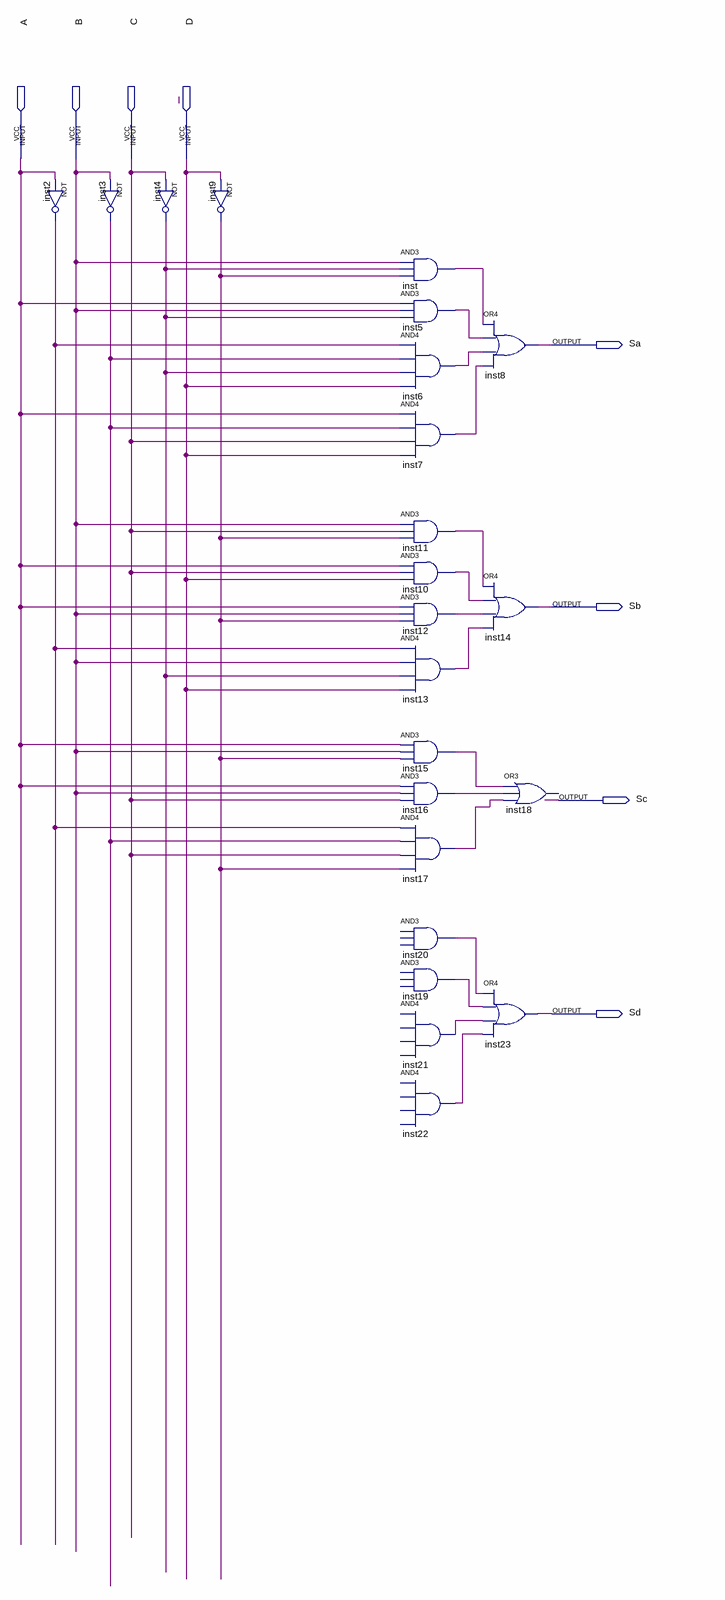
[diagram p0: schematic sheet]
// Quartus schematic lab03_vs.bdf as structural Verilog: 23 symbols, 8 pins
module lab03_vs (
  input  A,
  input  B,
  input  C,
  input  D,
  output Sa,
  output Sb,
  output Sc,
  output Sd
);

  wire inst2_out, inst3_out, inst4_out, inst5_out, inst6_out, inst7_out, inst9_out, inst10_out, inst11_out,
       inst12_out, inst13_out, inst15_out, inst16_out, inst17_out, inst19_out, inst20_out, inst21_out,
       inst22_out, inst_out;

  not inst2 (inst2_out, A);
  not inst3 (inst3_out, B);
  not inst4 (inst4_out, C);
  not inst9 (inst9_out, D);
  and inst (inst_out, B, inst4_out, inst9_out);
  and inst5 (inst5_out, A, B, inst4_out);
  and inst6 (inst6_out, inst2_out, inst3_out, inst4_out, D);
  and inst7 (inst7_out, A, inst3_out, C, D);
  and inst11 (inst11_out, B, C, inst9_out);
  and inst10 (inst10_out, A, C, D);
  and inst12 (inst12_out, A, B, inst9_out);
  and inst13 (inst13_out, inst2_out, B, inst4_out, D);
  and inst15 (inst15_out, A, B, inst9_out);
  and inst16 (inst16_out, A, B, C);
  and inst17 (inst17_out, inst2_out, inst3_out, C, inst9_out);
  // AND3 inst20 has open pins: IN1=open, IN2=open, IN3=open, OUT=inst20_out
  // AND3 inst19 has open pins: IN1=open, IN2=open, IN3=open, OUT=inst19_out
  // AND4 inst21 has open pins: IN1=open, IN2=open, IN3=open, IN4=open, OUT=inst21_out
  // AND4 inst22 has open pins: IN1=open, IN2=open, IN3=open, IN4=open, OUT=inst22_out
  or inst8 (Sa, inst_out, inst5_out, inst6_out, inst7_out);
  or inst14 (Sb, inst11_out, inst10_out, inst12_out, inst13_out);
  // OR3 inst18 has open pins: IN1=inst15_out, IN2=inst16_out, IN3=inst17_out, OUT=open
  or inst23 (Sd, inst20_out, inst19_out, inst21_out, inst22_out);
endmodule
